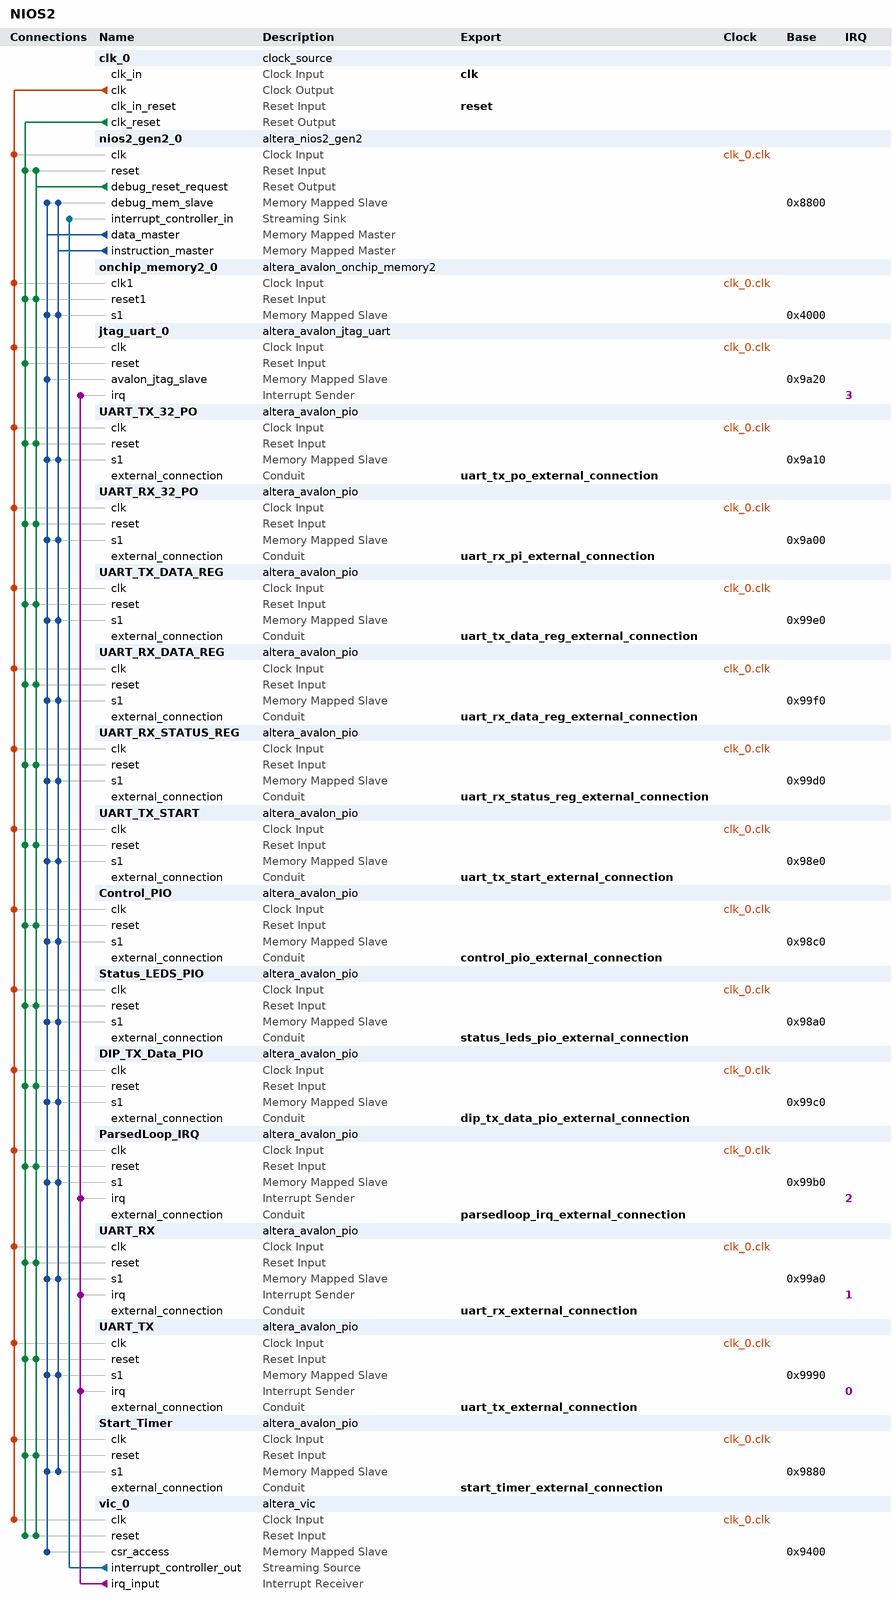
[diagram p0: system contents]
# Platform Designer (Qsys) system NIOS2, Cyclone IV E EP4CE6E22C8
# Parameters at their usual value, and those the tool derives, are not listed.
package require -exact qsys 22.1
create_system NIOS2
set_project_property DEVICE_FAMILY {Cyclone IV E}
set_project_property DEVICE EP4CE6E22C8

add_instance clk_0 clock_source 22.1
set_instance_parameter_value clk_0 clockFrequency 100000000

add_instance nios2_gen2_0 altera_nios2_gen2 22.1
set_instance_parameter_value nios2_gen2_0 dcache_size 2048
set_instance_parameter_value nios2_gen2_0 exceptionSlave onchip_memory2_0.s1
set_instance_parameter_value nios2_gen2_0 icache_size 4096
set_instance_parameter_value nios2_gen2_0 impl Fast
set_instance_parameter_value nios2_gen2_0 resetSlave onchip_memory2_0.s1
set_instance_parameter_value nios2_gen2_0 setting_interruptControllerType External
set_instance_parameter_value nios2_gen2_0 setting_shadowRegisterSets 16

add_instance onchip_memory2_0 altera_avalon_onchip_memory2 22.1
set_instance_parameter_value onchip_memory2_0 dataWidth 32
set_instance_parameter_value onchip_memory2_0 dualPort false
set_instance_parameter_value onchip_memory2_0 initMemContent true
set_instance_parameter_value onchip_memory2_0 initializationFileName onchip_mem.hex
set_instance_parameter_value onchip_memory2_0 memorySize 8192

add_instance jtag_uart_0 altera_avalon_jtag_uart 22.1
set_instance_parameter_value jtag_uart_0 simInteractiveOptions NO_INTERACTIVE_WINDOWS

add_instance UART_TX_32_PO altera_avalon_pio 22.1
set_instance_parameter_value UART_TX_32_PO direction Output
set_instance_parameter_value UART_TX_32_PO width 32

add_instance UART_RX_32_PO altera_avalon_pio 22.1
set_instance_parameter_value UART_RX_32_PO direction Output
set_instance_parameter_value UART_RX_32_PO width 32

add_instance UART_TX_DATA_REG altera_avalon_pio 22.1
set_instance_parameter_value UART_TX_DATA_REG direction Output
set_instance_parameter_value UART_TX_DATA_REG width 8

add_instance UART_RX_DATA_REG altera_avalon_pio 22.1
set_instance_parameter_value UART_RX_DATA_REG direction Input
set_instance_parameter_value UART_RX_DATA_REG width 8

add_instance UART_RX_STATUS_REG altera_avalon_pio 22.1
set_instance_parameter_value UART_RX_STATUS_REG direction Input
set_instance_parameter_value UART_RX_STATUS_REG width 2

add_instance UART_TX_START altera_avalon_pio 22.1
set_instance_parameter_value UART_TX_START direction Output
set_instance_parameter_value UART_TX_START width 1

add_instance Control_PIO altera_avalon_pio 22.1
set_instance_parameter_value Control_PIO bitModifyingOutReg true
set_instance_parameter_value Control_PIO direction Input
set_instance_parameter_value Control_PIO width 4

add_instance Status_LEDS_PIO altera_avalon_pio 22.1
set_instance_parameter_value Status_LEDS_PIO direction InOut
set_instance_parameter_value Status_LEDS_PIO width 4

add_instance DIP_TX_Data_PIO altera_avalon_pio 22.1
set_instance_parameter_value DIP_TX_Data_PIO direction Input
set_instance_parameter_value DIP_TX_Data_PIO width 8

add_instance ParsedLoop_IRQ altera_avalon_pio 22.1
set_instance_parameter_value ParsedLoop_IRQ captureEdge true
set_instance_parameter_value ParsedLoop_IRQ direction Input
set_instance_parameter_value ParsedLoop_IRQ generateIRQ true
set_instance_parameter_value ParsedLoop_IRQ irqType EDGE
set_instance_parameter_value ParsedLoop_IRQ width 1

add_instance UART_RX altera_avalon_pio 22.1
set_instance_parameter_value UART_RX captureEdge true
set_instance_parameter_value UART_RX direction Input
set_instance_parameter_value UART_RX generateIRQ true
set_instance_parameter_value UART_RX irqType EDGE
set_instance_parameter_value UART_RX width 1

add_instance UART_TX altera_avalon_pio 22.1
set_instance_parameter_value UART_TX captureEdge true
set_instance_parameter_value UART_TX direction Input
set_instance_parameter_value UART_TX generateIRQ true
set_instance_parameter_value UART_TX irqType EDGE
set_instance_parameter_value UART_TX width 1

add_instance Start_Timer altera_avalon_pio 22.1
set_instance_parameter_value Start_Timer direction Output
set_instance_parameter_value Start_Timer width 1

add_instance vic_0 altera_vic 22.1
set_instance_parameter_value vic_0 DAISY_CHAIN_ENABLE 0
set_instance_parameter_value vic_0 INTERRUPT_LATENCY_CYCLES 2
set_instance_parameter_value vic_0 NUMBER_OF_INT_PORTS 4
set_instance_parameter_value vic_0 OVERRIDE_INTERRUPT_LATENCY false
set_instance_parameter_value vic_0 RIL_WIDTH 3

# connections
add_connection clk_0.clk Control_PIO.clk clock
add_connection clk_0.clk DIP_TX_Data_PIO.clk clock
add_connection clk_0.clk jtag_uart_0.clk clock
add_connection clk_0.clk nios2_gen2_0.clk clock
add_connection clk_0.clk onchip_memory2_0.clk1 clock
add_connection clk_0.clk ParsedLoop_IRQ.clk clock
add_connection clk_0.clk Start_Timer.clk clock
add_connection clk_0.clk Status_LEDS_PIO.clk clock
add_connection clk_0.clk UART_RX.clk clock
add_connection clk_0.clk UART_RX_32_PO.clk clock
add_connection clk_0.clk UART_RX_DATA_REG.clk clock
add_connection clk_0.clk UART_RX_STATUS_REG.clk clock
add_connection clk_0.clk UART_TX.clk clock
add_connection clk_0.clk UART_TX_32_PO.clk clock
add_connection clk_0.clk UART_TX_DATA_REG.clk clock
add_connection clk_0.clk UART_TX_START.clk clock
add_connection clk_0.clk vic_0.clk clock
add_connection clk_0.clk_reset Control_PIO.reset reset
add_connection clk_0.clk_reset DIP_TX_Data_PIO.reset reset
add_connection clk_0.clk_reset jtag_uart_0.reset reset
add_connection clk_0.clk_reset nios2_gen2_0.reset reset
add_connection clk_0.clk_reset onchip_memory2_0.reset1 reset
add_connection clk_0.clk_reset ParsedLoop_IRQ.reset reset
add_connection clk_0.clk_reset Start_Timer.reset reset
add_connection clk_0.clk_reset Status_LEDS_PIO.reset reset
add_connection clk_0.clk_reset UART_RX.reset reset
add_connection clk_0.clk_reset UART_RX_32_PO.reset reset
add_connection clk_0.clk_reset UART_RX_DATA_REG.reset reset
add_connection clk_0.clk_reset UART_RX_STATUS_REG.reset reset
add_connection clk_0.clk_reset UART_TX.reset reset
add_connection clk_0.clk_reset UART_TX_32_PO.reset reset
add_connection clk_0.clk_reset UART_TX_DATA_REG.reset reset
add_connection clk_0.clk_reset UART_TX_START.reset reset
add_connection clk_0.clk_reset vic_0.reset reset
add_connection nios2_gen2_0.debug_reset_request Control_PIO.reset reset
add_connection nios2_gen2_0.debug_reset_request DIP_TX_Data_PIO.reset reset
add_connection nios2_gen2_0.debug_reset_request nios2_gen2_0.reset reset
add_connection nios2_gen2_0.debug_reset_request onchip_memory2_0.reset1 reset
add_connection nios2_gen2_0.debug_reset_request ParsedLoop_IRQ.reset reset
add_connection nios2_gen2_0.debug_reset_request Start_Timer.reset reset
add_connection nios2_gen2_0.debug_reset_request Status_LEDS_PIO.reset reset
add_connection nios2_gen2_0.debug_reset_request UART_RX.reset reset
add_connection nios2_gen2_0.debug_reset_request UART_RX_32_PO.reset reset
add_connection nios2_gen2_0.debug_reset_request UART_RX_DATA_REG.reset reset
add_connection nios2_gen2_0.debug_reset_request UART_RX_STATUS_REG.reset reset
add_connection nios2_gen2_0.debug_reset_request UART_TX.reset reset
add_connection nios2_gen2_0.debug_reset_request UART_TX_32_PO.reset reset
add_connection nios2_gen2_0.debug_reset_request UART_TX_DATA_REG.reset reset
add_connection nios2_gen2_0.debug_reset_request UART_TX_START.reset reset
add_connection nios2_gen2_0.debug_reset_request vic_0.reset reset
add_connection nios2_gen2_0.data_master Control_PIO.s1 avalon
set_connection_parameter_value nios2_gen2_0.data_master/Control_PIO.s1 baseAddress 0x98c0
add_connection nios2_gen2_0.data_master DIP_TX_Data_PIO.s1 avalon
set_connection_parameter_value nios2_gen2_0.data_master/DIP_TX_Data_PIO.s1 baseAddress 0x99c0
add_connection nios2_gen2_0.data_master jtag_uart_0.avalon_jtag_slave avalon
set_connection_parameter_value nios2_gen2_0.data_master/jtag_uart_0.avalon_jtag_slave baseAddress 0x9a20
add_connection nios2_gen2_0.data_master nios2_gen2_0.debug_mem_slave avalon
set_connection_parameter_value nios2_gen2_0.data_master/nios2_gen2_0.debug_mem_slave baseAddress 0x8800
add_connection nios2_gen2_0.data_master onchip_memory2_0.s1 avalon
set_connection_parameter_value nios2_gen2_0.data_master/onchip_memory2_0.s1 baseAddress 0x4000
add_connection nios2_gen2_0.data_master ParsedLoop_IRQ.s1 avalon
set_connection_parameter_value nios2_gen2_0.data_master/ParsedLoop_IRQ.s1 baseAddress 0x99b0
add_connection nios2_gen2_0.data_master Start_Timer.s1 avalon
set_connection_parameter_value nios2_gen2_0.data_master/Start_Timer.s1 baseAddress 0x9880
add_connection nios2_gen2_0.data_master Status_LEDS_PIO.s1 avalon
set_connection_parameter_value nios2_gen2_0.data_master/Status_LEDS_PIO.s1 baseAddress 0x98a0
add_connection nios2_gen2_0.data_master UART_RX.s1 avalon
set_connection_parameter_value nios2_gen2_0.data_master/UART_RX.s1 baseAddress 0x99a0
add_connection nios2_gen2_0.data_master UART_RX_32_PO.s1 avalon
set_connection_parameter_value nios2_gen2_0.data_master/UART_RX_32_PO.s1 baseAddress 0x9a00
add_connection nios2_gen2_0.data_master UART_RX_DATA_REG.s1 avalon
set_connection_parameter_value nios2_gen2_0.data_master/UART_RX_DATA_REG.s1 baseAddress 0x99f0
add_connection nios2_gen2_0.data_master UART_RX_STATUS_REG.s1 avalon
set_connection_parameter_value nios2_gen2_0.data_master/UART_RX_STATUS_REG.s1 baseAddress 0x99d0
add_connection nios2_gen2_0.data_master UART_TX.s1 avalon
set_connection_parameter_value nios2_gen2_0.data_master/UART_TX.s1 baseAddress 0x9990
add_connection nios2_gen2_0.data_master UART_TX_32_PO.s1 avalon
set_connection_parameter_value nios2_gen2_0.data_master/UART_TX_32_PO.s1 baseAddress 0x9a10
add_connection nios2_gen2_0.data_master UART_TX_DATA_REG.s1 avalon
set_connection_parameter_value nios2_gen2_0.data_master/UART_TX_DATA_REG.s1 baseAddress 0x99e0
add_connection nios2_gen2_0.data_master UART_TX_START.s1 avalon
set_connection_parameter_value nios2_gen2_0.data_master/UART_TX_START.s1 baseAddress 0x98e0
add_connection nios2_gen2_0.data_master vic_0.csr_access avalon
set_connection_parameter_value nios2_gen2_0.data_master/vic_0.csr_access baseAddress 0x9400
add_connection nios2_gen2_0.instruction_master Control_PIO.s1 avalon
set_connection_parameter_value nios2_gen2_0.instruction_master/Control_PIO.s1 baseAddress 0x98c0
add_connection nios2_gen2_0.instruction_master DIP_TX_Data_PIO.s1 avalon
set_connection_parameter_value nios2_gen2_0.instruction_master/DIP_TX_Data_PIO.s1 baseAddress 0x99c0
add_connection nios2_gen2_0.instruction_master nios2_gen2_0.debug_mem_slave avalon
set_connection_parameter_value nios2_gen2_0.instruction_master/nios2_gen2_0.debug_mem_slave baseAddress 0x8800
add_connection nios2_gen2_0.instruction_master onchip_memory2_0.s1 avalon
set_connection_parameter_value nios2_gen2_0.instruction_master/onchip_memory2_0.s1 baseAddress 0x4000
add_connection nios2_gen2_0.instruction_master ParsedLoop_IRQ.s1 avalon
set_connection_parameter_value nios2_gen2_0.instruction_master/ParsedLoop_IRQ.s1 baseAddress 0x99b0
add_connection nios2_gen2_0.instruction_master Start_Timer.s1 avalon
set_connection_parameter_value nios2_gen2_0.instruction_master/Start_Timer.s1 baseAddress 0x9880
add_connection nios2_gen2_0.instruction_master Status_LEDS_PIO.s1 avalon
set_connection_parameter_value nios2_gen2_0.instruction_master/Status_LEDS_PIO.s1 baseAddress 0x98a0
add_connection nios2_gen2_0.instruction_master UART_RX.s1 avalon
set_connection_parameter_value nios2_gen2_0.instruction_master/UART_RX.s1 baseAddress 0x99a0
add_connection nios2_gen2_0.instruction_master UART_RX_32_PO.s1 avalon
set_connection_parameter_value nios2_gen2_0.instruction_master/UART_RX_32_PO.s1 baseAddress 0x9a00
add_connection nios2_gen2_0.instruction_master UART_RX_DATA_REG.s1 avalon
set_connection_parameter_value nios2_gen2_0.instruction_master/UART_RX_DATA_REG.s1 baseAddress 0x99f0
add_connection nios2_gen2_0.instruction_master UART_RX_STATUS_REG.s1 avalon
set_connection_parameter_value nios2_gen2_0.instruction_master/UART_RX_STATUS_REG.s1 baseAddress 0x99d0
add_connection nios2_gen2_0.instruction_master UART_TX.s1 avalon
set_connection_parameter_value nios2_gen2_0.instruction_master/UART_TX.s1 baseAddress 0x9990
add_connection nios2_gen2_0.instruction_master UART_TX_32_PO.s1 avalon
set_connection_parameter_value nios2_gen2_0.instruction_master/UART_TX_32_PO.s1 baseAddress 0x9a10
add_connection nios2_gen2_0.instruction_master UART_TX_DATA_REG.s1 avalon
set_connection_parameter_value nios2_gen2_0.instruction_master/UART_TX_DATA_REG.s1 baseAddress 0x99e0
add_connection nios2_gen2_0.instruction_master UART_TX_START.s1 avalon
set_connection_parameter_value nios2_gen2_0.instruction_master/UART_TX_START.s1 baseAddress 0x98e0
add_connection vic_0.interrupt_controller_out nios2_gen2_0.interrupt_controller_in avalon_streaming
add_connection vic_0.irq_input jtag_uart_0.irq interrupt
set_connection_parameter_value vic_0.irq_input/jtag_uart_0.irq irqNumber 3
add_connection vic_0.irq_input ParsedLoop_IRQ.irq interrupt
set_connection_parameter_value vic_0.irq_input/ParsedLoop_IRQ.irq irqNumber 2
add_connection vic_0.irq_input UART_RX.irq interrupt
set_connection_parameter_value vic_0.irq_input/UART_RX.irq irqNumber 1
add_connection vic_0.irq_input UART_TX.irq interrupt
set_connection_parameter_value vic_0.irq_input/UART_TX.irq irqNumber 0

# exported interfaces
add_interface clk clock sink
set_interface_property clk EXPORT_OF clk_0.clk_in
add_interface control_pio_external_connection conduit end
set_interface_property control_pio_external_connection EXPORT_OF Control_PIO.external_connection
add_interface dip_tx_data_pio_external_connection conduit end
set_interface_property dip_tx_data_pio_external_connection EXPORT_OF DIP_TX_Data_PIO.external_connection
add_interface parsedloop_irq_external_connection conduit end
set_interface_property parsedloop_irq_external_connection EXPORT_OF ParsedLoop_IRQ.external_connection
add_interface reset reset sink
set_interface_property reset EXPORT_OF clk_0.clk_in_reset
add_interface start_timer_external_connection conduit end
set_interface_property start_timer_external_connection EXPORT_OF Start_Timer.external_connection
add_interface status_leds_pio_external_connection conduit end
set_interface_property status_leds_pio_external_connection EXPORT_OF Status_LEDS_PIO.external_connection
add_interface uart_rx_data_reg_external_connection conduit end
set_interface_property uart_rx_data_reg_external_connection EXPORT_OF UART_RX_DATA_REG.external_connection
add_interface uart_rx_external_connection conduit end
set_interface_property uart_rx_external_connection EXPORT_OF UART_RX.external_connection
add_interface uart_rx_pi_external_connection conduit end
set_interface_property uart_rx_pi_external_connection EXPORT_OF UART_RX_32_PO.external_connection
add_interface uart_rx_status_reg_external_connection conduit end
set_interface_property uart_rx_status_reg_external_connection EXPORT_OF UART_RX_STATUS_REG.external_connection
add_interface uart_tx_data_reg_external_connection conduit end
set_interface_property uart_tx_data_reg_external_connection EXPORT_OF UART_TX_DATA_REG.external_connection
add_interface uart_tx_external_connection conduit end
set_interface_property uart_tx_external_connection EXPORT_OF UART_TX.external_connection
add_interface uart_tx_po_external_connection conduit end
set_interface_property uart_tx_po_external_connection EXPORT_OF UART_TX_32_PO.external_connection
add_interface uart_tx_start_external_connection conduit end
set_interface_property uart_tx_start_external_connection EXPORT_OF UART_TX_START.external_connection

set_interconnect_requirement {$system} qsys_mm.clockCrossingAdapter HANDSHAKE
set_interconnect_requirement {$system} qsys_mm.enableEccProtection FALSE
set_interconnect_requirement {$system} qsys_mm.insertDefaultSlave FALSE
set_interconnect_requirement {$system} qsys_mm.maxAdditionalLatency 1

save_system NIOS2.qsys
